# Altium schematic sheet LT4320IMSE#PBF1_LT4320IMSE#PBF.schdoc
size 127 x 99 mm
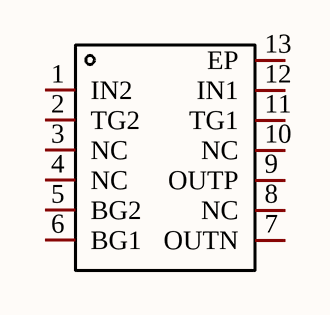
[diagram p0: LT4320IMSE#PBF1_LT4320IMSE#PBF.schdoc]

## Parts
U?  LT4320IMSE#PBF  [MSOP-12_L4.0-W3.0-P0.65-LS4.9-BL-EP]  (value not drawn)

## Nets

Not connected (* = marked no-connect by the designer): U? 1(IN2) 2(TG2) 3(NC) 4(NC) 5(BG2) 6(BG1) 7(OUTN) 8(NC) 9(OUTP) 10(NC) 11(TG1) 12(IN1) 13(EP)

## Library data of the parts
U? = LT4320IMSE#PBF: Manufacturer: ADI(亚德诺)/LINEAR(凌特); Add into BOM: yes; Name: LT4320IMSE#PBF; Symbol: LT4320IMSE#PBF; Device: LT4320IMSE#PBF; LCSC Part Name: LT4320IMSE#PBF; Supplier Part: C580181; Manufacturer Part: LT4320IMSE#PBF; Supplier Footprint: MSOP-12-EP-0.65mm; JLCPCB Part Class: Extended Part; Datasheet: https://atta.szlcsc.com/upload/public/pdf/source/20200904/C672451_3866601E11BCA9D43DEBB9978F5AD036.pdf; Supplier: LCSC; Convert to PCB: yes